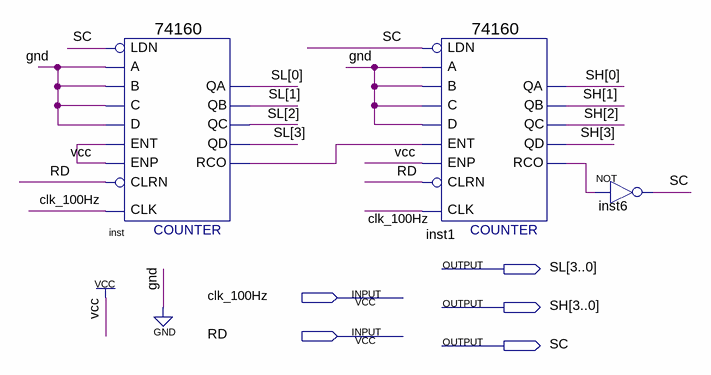
[diagram p0: schematic sheet]
// Quartus schematic 100f.bdf as structural Verilog: 3 symbols, 5 pins
module \100f  (
  input  clk_100Hz,
  input  RD,
  output [3:0] SL,
  output [3:0] SH,
  output SC
);

  wire inst1_rco, inst_rco;

  \74160  inst (
    .CLK(clk_100Hz), .ENT(1'b1), .A(1'b0), .B(1'b0), .C(1'b0), .D(1'b0), .LDN(SC), .ENP(1'b1), .CLRN(RD),
    .QD(SL[3]), .QA(SL[0]), .QB(SL[1]), .QC(SL[2]), .RCO(inst_rco));
  \74160  inst1 (
    .CLK(clk_100Hz), .ENT(inst_rco), .A(1'b0), .B(1'b0), .C(1'b0), .D(1'b0), .LDN(SC), .ENP(1'b1), .CLRN(RD),
    .QD(SH[3]), .QA(SH[0]), .QB(SH[1]), .QC(SH[2]), .RCO(inst1_rco));
  not inst6 (SC, inst1_rco);
endmodule
